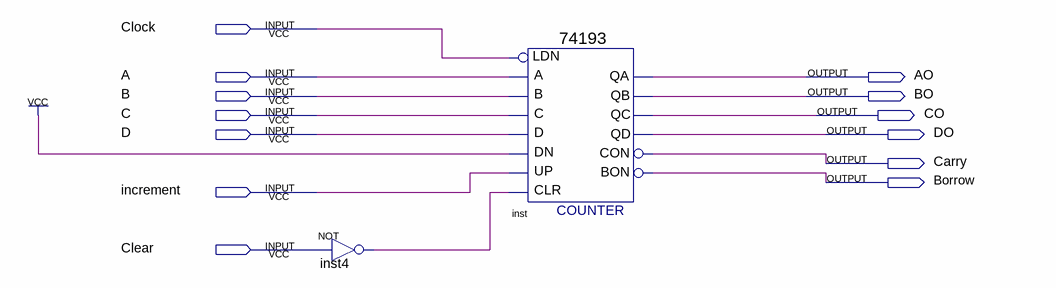
[diagram p0: schematic sheet]
// Quartus schematic BC.bdf as structural Verilog: 2 symbols, 13 pins
module BC (
  input  Clock,
  input  A,
  input  B,
  input  C,
  input  D,
  input  increment,
  input  Clear,
  output AO,
  output BO,
  output CO,
  output DO,
  output Carry,
  output Borrow
);

  wire inst4_out;

  not inst4 (inst4_out, Clear);
  \74193  inst (
    .D(D), .C(C), .B(B), .A(A), .CLR(inst4_out), .UP(increment), .DN(1'b1), .LDN(Clock), .QB(BO), .QA(AO),
    .CON(Carry), .QD(DO), .QC(CO), .BON(Borrow));
endmodule
